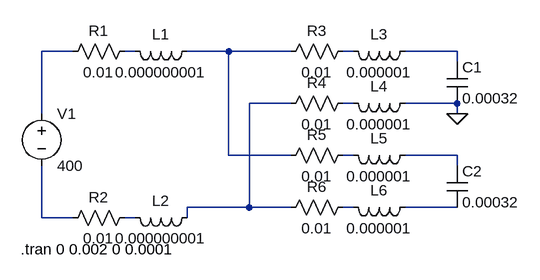
[diagram p0: schematic test-senza-trans.asc]
test-senza-trans.asc, the LTspice schematic file:
Version 4
SHEET 1 880 680
WIRE 0 80 -48 80
WIRE 96 80 80 80
WIRE 240 80 176 80
WIRE 336 80 240 80
WIRE 432 80 416 80
WIRE 592 80 512 80
WIRE 592 96 592 80
WIRE 336 160 272 160
WIRE 432 160 416 160
WIRE 592 160 512 160
WIRE -48 176 -48 80
WIRE 592 176 592 160
WIRE 240 240 240 80
WIRE 336 240 240 240
WIRE 432 240 416 240
WIRE 592 240 512 240
WIRE 592 256 592 240
WIRE 272 320 272 160
WIRE 272 320 176 320
WIRE 336 320 272 320
WIRE 432 320 416 320
WIRE 592 320 512 320
WIRE -48 336 -48 256
WIRE 0 336 -48 336
WIRE 96 336 80 336
WIRE 176 336 176 320
FLAG 592 176 0
SYMBOL voltage -48 160 R0
WINDOW 123 0 0 Left 0
WINDOW 39 0 0 Left 0
SYMATTR InstName V1
SYMATTR Value 400
SYMBOL res 96 64 R90
WINDOW 0 0 56 VBottom 2
WINDOW 3 32 56 VTop 2
SYMATTR InstName R1
SYMATTR Value 0.01
SYMBOL res 96 320 R90
WINDOW 0 0 56 VBottom 2
WINDOW 3 32 56 VTop 2
SYMATTR InstName R2
SYMATTR Value 0.01
SYMBOL res 432 64 R90
WINDOW 0 0 56 VBottom 2
WINDOW 3 32 56 VTop 2
SYMATTR InstName R3
SYMATTR Value 0.01
SYMBOL res 432 144 R90
WINDOW 0 0 56 VBottom 2
WINDOW 3 32 56 VTop 2
SYMATTR InstName R4
SYMATTR Value 0.01
SYMBOL res 432 224 R90
WINDOW 0 0 56 VBottom 2
WINDOW 3 32 56 VTop 2
SYMATTR InstName R5
SYMATTR Value 0.01
SYMBOL res 432 304 R90
WINDOW 0 0 56 VBottom 2
WINDOW 3 32 56 VTop 2
SYMATTR InstName R6
SYMATTR Value 0.01
SYMBOL ind 192 64 R90
WINDOW 0 5 56 VBottom 2
WINDOW 3 32 56 VTop 2
SYMATTR InstName L1
SYMATTR Value 0.000000001
SYMBOL ind 192 320 R90
WINDOW 0 5 56 VBottom 2
WINDOW 3 32 56 VTop 2
SYMATTR InstName L2
SYMATTR Value 0.000000001
SYMBOL ind 528 64 R90
WINDOW 0 5 56 VBottom 2
WINDOW 3 32 56 VTop 2
SYMATTR InstName L3
SYMATTR Value 0.000001
SYMBOL ind 528 144 R90
WINDOW 0 5 56 VBottom 2
WINDOW 3 32 56 VTop 2
SYMATTR InstName L4
SYMATTR Value 0.000001
SYMBOL ind 528 224 R90
WINDOW 0 5 56 VBottom 2
WINDOW 3 32 56 VTop 2
SYMATTR InstName L5
SYMATTR Value 0.000001
SYMBOL ind 528 304 R90
WINDOW 0 5 56 VBottom 2
WINDOW 3 32 56 VTop 2
SYMATTR InstName L6
SYMATTR Value 0.000001
SYMBOL cap 576 96 R0
SYMATTR InstName C1
SYMATTR Value 0.00032
SYMBOL cap 576 256 R0
SYMATTR InstName C2
SYMATTR Value 0.00032
TEXT -80 384 Left 2 !.tran 0 0.002 0 0.0001

The netlist it stands for:
* test-senza-trans.asc
V1 N001 N012 400
R1 N002 N001 0.01
R2 N013 N012 0.01
R3 N004 N003 0.01
R4 N007 N006 0.01
R5 N008 N003 0.01
R6 N010 N006 0.01
L1 N003 N002 0.000000001
L2 N006 N013 0.000000001
L3 N005 N004 0.000001
L4 0 N007 0.000001
L5 N009 N008 0.000001
L6 N011 N010 0.000001
C1 N005 0 0.00032
C2 N009 N011 0.00032
.tran 0 0.002 0 0.0001
.backanno
.end